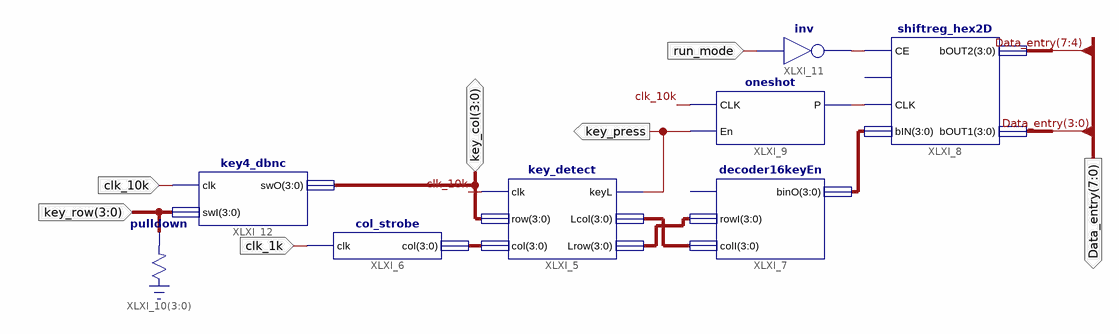
[diagram p0: schematic sheet 1]
// Xilinx ISE schematic keypad_input.sch (spartan3e) as structural Verilog: 8 symbols, 7 ports
module keypad_input (
  input  clk_1k,
  input  [3:0] key_row,
  input  clk_10k,
  input  run_mode,
  inout  [3:0] key_col,
  output key_press,
  output [7:0] Data_entry
);

  wire XLXN_8, XLXN_17;
  wire [3:0] XLXN_3, XLXN_4, XLXN_5, XLXN_6;

  key_detect XLXI_5 (.clk(clk_10k), .row(key_col), .col(XLXN_3), .keyL(key_press), .Lcol(XLXN_4), .Lrow(XLXN_5));
  col_strobe XLXI_6 (.clk(clk_1k), .col(XLXN_3));
  decoder16keyEn XLXI_7 (.rowI(XLXN_5), .colI(XLXN_4), .binO(XLXN_6));  // open: En
  shiftreg_hex2D XLXI_8 (
    .CE(XLXN_17), .CLK(XLXN_8), .bIN(XLXN_6), .bOUT2(Data_entry[7:4]), .bOUT1(Data_entry[3:0]));  // open: RST
  oneshot XLXI_9 (.CLK(clk_10k), .En(key_press), .P(XLXN_8));
  \pulldown  XLXI_10[3:0] (.O(key_row));
  not XLXI_11 (XLXN_17, run_mode);
  key4_dbnc XLXI_12 (.clk(clk_10k), .swI(key_row), .swO(key_col));
endmodule
